# EasyEDA Pro project SlimeVR.eprj

# Schematic 板子原理图
Board Name: SlimeVR; Create Date: 2025-01-03; Page Name: 就这一页; Project Name: ReSlimeVR; Schematic Name: 板子原理图; Update Date: 2025-02-01; Company: 我们没有工作室(；´д｀)ゞ; Drawed: Abstract; Page Size: A4; Reviewed: Abstract; Version: V1.0
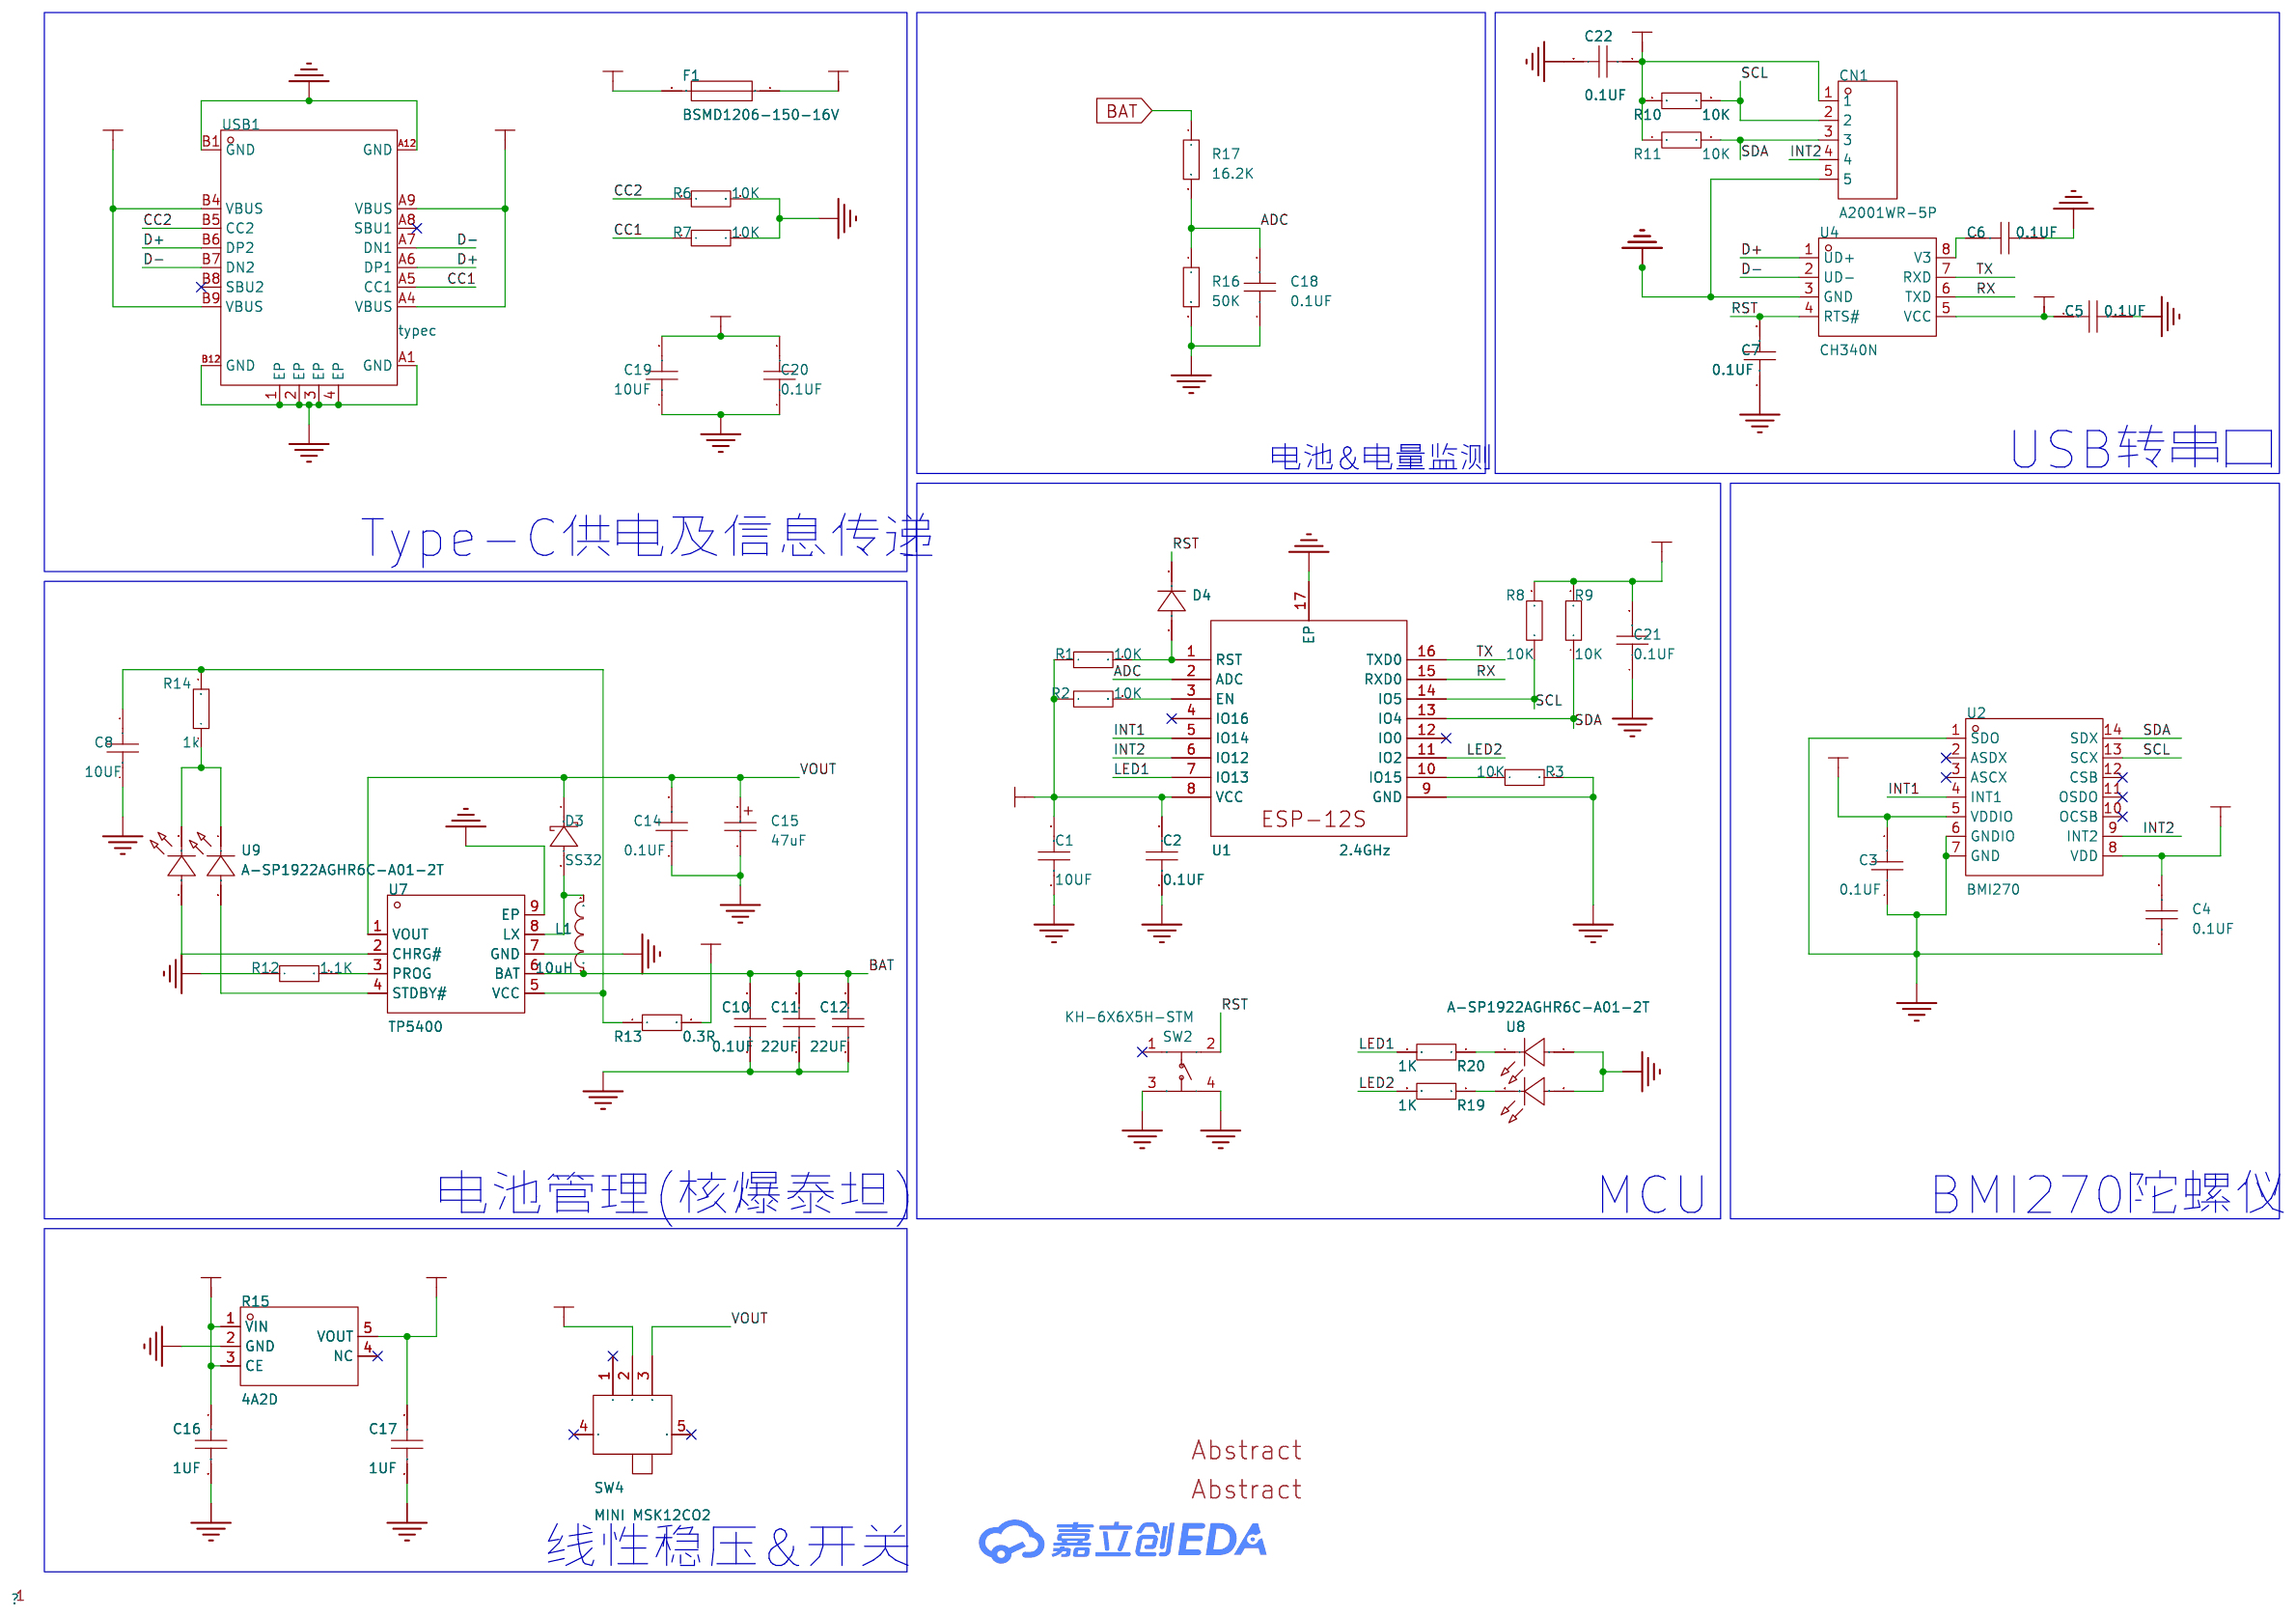
[diagram p0: schematic sheet]

## Parts
C1  10UF  [C0805]
C2  0.1UF  [C0805]
C3  0.1UF  [C0805]
C4  0.1UF  [C0805]
C5  0.1UF  [C0805]
C6  0.1UF  [C0805]
C7  0.1UF  [C0805]
C8  10UF  [C0805]
C10  0.1UF  [C0805]
C11  22UF  [C0805]
C12  22UF  [C0805]
C14  0.1UF  [C0805]
C15  47uF  [CASE-A_3216]
C16  1UF  [C0805]
C17  1UF  [C0805]
C18  0.1UF  [C0805]
C19  10UF  [C0805]
C20  0.1UF  [C0805]
C21  0.1UF  [C0805]
C22  0.1UF  [C0805]
CN1  A2001WR-5P  [CONN-TH_A2001WR-5P]
D3  SS32  [SMAF_L4.3-W2.5-LS5.0-RD]
D4  -  [SMA_1N4007]
F1  BSMD1206-150-16V  [F1206]
L1  10uH  [L0805]
R1  10K  [R0805]
R2  10K  [R0805]
R3  10K  [R0805]
R6  10K  [R0805]
R7  10K  [R0805]
R8  10K  [R0805]
R9  10K  [R0805]
R10  10K  [R0805]
R11  10K  [R0805]
R12  1.1K  [R0805]
R13  0.3R  [R0805]
R14  1k  [R0805]
R15  4A2D  [SOT-23-5_L3.0-W1.7-P0.95-LS2.8-BL]
R16  50K  [R0805]
R17  16.2K  [R0805]
R19  1K  [R0805]
R20  1K  [R0805]
SW2  KH-6X6X5H-STM  [SW-SMD_4P-L6.0-W6.0-P4.50-LS9.0-2]
SW4  MINI MSK12CO2  [SW-SMD_MSK12CO2]
U1  2.4GHz  [WIRELM-SMD_ESP-12S]
U2  BMI270  [LGA-14_L3.0-W2.5-P0.50-BR]
U4  CH340N  [SOP-8_L4.9-W3.9-P1.27-LS6.0-BL]
U7  TP5400  [ESOP-8_L4.9-W3.9-P1.27-LS6.0-BL-EP]
U8  A-SP1922AGHR6C-A01-2T  [LED-SMD_4P-L1.6-W1.5-BL-1]
U9  A-SP1922AGHR6C-A01-2T  [LED-SMD_4P-L1.6-W1.5-BL-1]
USB1  typec  [USB-C-SMD_KH-TYPE-C-16P]

## Library data of the parts
C1-C8 C10-C12 C14 C16-C22 = CAP_0805: Supplier Footprint: 0805
C15 = TAJA476K006RNJ: LCSC Part Name: 47uF ±10% 6.3V; Supplier Part: C7190; Manufacturer: Kyocera AVX; Supplier Footprint: CASE-A-3216; JLCPCB Part Class: 扩展库; Datasheet: https://atta.szlcsc.com/upload/public/pdf/source/20160107/1457707750344.pdf; Supplier: LCSC; Tolerance: ±10%; Rated Voltage: 6.3V; Equivalent Series Resistance(ESR): 1.6Ω@100kHz; Operating Temperature: -55℃~+125℃
CN1 = A2001WR-5P: LCSC Part Name: 系列:PH 间距:2mm 1x5P; Supplier Part: C225210; Manufacturer: CJT(长江连接器); Supplier Footprint: 弯插,P=2mm; JLCPCB Part Class: 扩展库; Datasheet: https://atta.szlcsc.com/upload/public/pdf/source/20180913/C273054_6FC7409D4269AF7235E8BCB17617615A.pdf; Supplier: LCSC; Pins Structure: 1x5P; Pitch: 2mm; Mounting Style: 弯插; Reference Series: PH; Number of Pins: 5P; Number of Rows: 1; Number of PINs Per Row: 5; Contact Material: 黄铜
D3 = SS32: LCSC Part Name: 电压:20V 电流:3A; Supplier Part: C727059; Manufacturer: TWGMC(台湾迪嘉); Supplier Footprint: SMA(DO-214AC); JLCPCB Part Class: 扩展库; Datasheet: https://atta.szlcsc.com/upload/public/pdf/source/20200828/C727059_6599B6CAC5F3238B9C33E46794659DBE.pdf; Supplier: LCSC; Diode Configuration: 独立式; Forward Voltage (Vf@If): 550mV@3A; Reverse Voltage (Vr): 20V; Rectified Current: 3A; Reverse Leakage Current (Ir): 500uA
D4 = D_1N4007: Supplier Footprint: SMA
F1 = BSMD1206-150-16V: LCSC Part Name: 16V 1.5A 1206自恢复; Supplier Part: C883133; Manufacturer: BHFUSE(佰宏); Supplier Footprint: 1206; JLCPCB Part Class: 扩展库; Datasheet: https://atta.szlcsc.com/upload/public/pdf/source/20230512/E419278EC8529AAF514173EF221BCF4B.pdf; Supplier: LCSC; Operating Voltage (Max): 16V; Current Rating (Max): 40A; Hold Current: 1.5A; Trip Current: 3A; Power Dissipation: 1W; Resistance - Initial (Ri) (Min): 25mΩ; Resistance - Post Trip (R1) (Max): 130mΩ; Maximum Time to Trip: 300ms; Operating Temperature: -40℃~+85℃
L1 = L_0805
R1-R3 R6-R14 R16 R17 R19 R20 = Res_0805: Supplier Footprint: 0805
R15 = 4A2D: Supplier Part: C2832127; Manufacturer: FM(富满); Supplier Footprint: SOT-23-5; JLCPCB Part Class: 扩展库; Datasheet: https://atta.szlcsc.com/upload/public/pdf/source/20211108/383E30205ACCFA4DE55639D1C9215A3C.pdf; Supplier: LCSC
SW2 = KH-6X6X5H-STM: LCSC Part Name: 6*6*5mm 立贴 轻触开关; Supplier Part: C2837531; Manufacturer: kinghelm(金航标); Supplier Footprint: SMD; JLCPCB Part Class: 扩展库; Datasheet: https://atta.szlcsc.com/upload/public/pdf/source/20210608/C2837531_45E87AB996CE723B09405FF2EA209C4C.pdf; Supplier: LCSC; Circuit: 单刀单掷; Actuator Style: 圆形按钮; Mounting Style: 立贴; Switch Length: 6mm; Switch Width: 6mm; Switch Height: 5mm; Strike Gundam: 不带; Contact Current: 50mA; Voltage Rating (DC): 12V; Actuator/Cap Color: 黑色; Pin Style: 鸥翼型; Mechanical Life: 8万次
SW4 = MINI MSK12CO2: LCSC Part Name: 迷你七脚两档侧拨拨动 mini七7脚 微型拨动; Supplier Part: C2681570; Manufacturer: SHOU HAN(首韩); Supplier Footprint: SMD; JLCPCB Part Class: 扩展库; Datasheet: https://atta.szlcsc.com/upload/public/pdf/source/20210224/C2681570_D263F9C605E4588A4AE6114B72AE4C72.pdf; Supplier: LCSC; Circuit: 单刀双掷; Pin Style: SMD接片; Switch Length: 5mm; Switch Width: 2.75mm; Switch Height: 1.4mm; Mounting Style: 卧贴; Current Rating (DC): 50mA; Voltage Rating (DC): 12V; Mechanical Life: 1万次; Operating Temperature: -16℃~+60℃
U1 = ESP-12S: Supplier Part: C82898; Manufacturer: Ai-Thinker(安信可); Supplier Footprint: SMD,16x24mm; JLCPCB Part Class: 扩展库; Datasheet: https://atta.szlcsc.com/upload/public/pdf/source/20180726/C82898_9FA1708C134FC93491C81360A8B073B0.pdf; Supplier: LCSC; Core Processor: ESP8266芯片; Wireless Standard: 802.11b/g/n；IP；TCP; Support Interface: GPIO；UART；PWM；ADC; Antenna Type: 板载PCB天线; Output Power: 16dBm; Operating Voltage: 3.3V; Receive  Current: 56mA; Send  Current: 170mA; Sensitivity: -90dBm; Operating Temperature: -20℃~+85℃
U2 = BMI270: Supplier Part: C2836813; Manufacturer: Bosch(博世); Supplier Footprint: LGA-14(2.5x3); JLCPCB Part Class: 扩展库; Datasheet: https://atta.szlcsc.com/upload/public/pdf/source/20210625/C2836813_35E1F3F92097F45A3828DF13DDBA01A5.pdf; Supplier: LCSC; Sensor Type: 加速度计陀螺仪; Operating Temperature: -40℃~+85℃
U4 = CH340N: LCSC Part Name: USB转串口芯片CH340; Supplier Part: C2977777; Manufacturer: WCH(南京沁恒); Supplier Footprint: SOP-8; JLCPCB Part Class: 扩展库; Datasheet: https://atta.szlcsc.com/upload/public/pdf/source/20240313/115CDE92081B1D6CB446704AD5D0F5F2.pdf; Supplier: LCSC; Applications Function: USB转串口; Protocol: USB 2.0; Number of Channels: 1; Supply Voltage: 3.3V；5V; Data Rate: 2Mbps; Operating Temperature: -20℃~+70℃
U7 = TP5400: Supplier Part: C2891434; Manufacturer: TOPPOWER(南京拓微); Supplier Footprint: ESOP-8; JLCPCB Part Class: 扩展库; Datasheet: https://atta.szlcsc.com/upload/public/pdf/source/20210909/352D9D40D77A1DD73F7904E364EF004B.pdf; Supplier: LCSC
U8 U9 = A-SP1922AGHR6C-A01-2T: LCSC Part Name: 1615绿红双色正贴; Supplier Part: C19171268; Manufacturer: Amicc(欧密格光电); Supplier Footprint: SMD-4P,1.6x1.5mm; Datasheet: https://atta.szlcsc.com/upload/public/pdf/source/20231108/782416AD03B76E14CF2487C8CE3D30D8.pdf; Supplier: LCSC; Emitted Color: 红色,绿色; Power Dissipation: 95mW；60mW; Dominant Wavelength: 515nm~530nm；622nm; Lens Color: 无色透明透镜; Luminous Intensity: 180mcd~285mcd；360mcd~900mcd; Viewing Angle: 130°; Mounting Sytle: 正贴; Operating Temperature: -40℃~+85℃
USB1 = typec: Supplier Part: C9900016956; Supplier Footprint: typec 12p; JLCPCB Part Class: 扩展库; Supplier: LCSC

## Nets
3.3V: C1.2 C2.2 C3.2 C4.2 C17.1 C21.2 C22.1 CN1.1 R1.1 R2.1 R8.2 R9.2 R10.1 R11.1 R15.5(VOUT) U1.8(VCC) U2.5(VDDIO) U2.8(VDD)
5V: C16.1 R15.1(VIN) R15.3(CE) SW4.2
GND: C1.1 C2.1 C3.1 C4.1 C5.2 C6.2 C7.1 C8.1 C10.1 C11.1 C12.1 C14.1 C15.2 C16.2 C17.2 C18.1 C19.1 C20.1 C21.1 C22.2 CN1.5 R3.2 R6.2 R7.2 R12.1 R15.2(GND) R16.2 SW2.3 SW2.4 U1.9(GND) U1.17(EP) U2.1(SDO) U2.6(GNDIO) U2.7(GND) U4.3(GND) U7.7(GND) U7.9(EP) U8.1 U8.2 USB1.1(EP) USB1.2(EP) USB1.3(EP) USB1.4(EP) USB1.A1(GND) USB1.A12(GND) USB1.B1(GND) USB1.B12(GND)
VBUS: C19.2 C20.2 F1.1 USB1.A4(VBUS) USB1.A9(VBUS) USB1.B4(VBUS) USB1.B9(VBUS)
ADC: C18.2 R16.1 R17.2 U1.2(ADC)
BAT: C10.2 C11.2 C12.2 L1.1 R17.1 U7.6(BAT)
CC1: R7.1 USB1.A5(CC1)
CC2: R6.1 USB1.B5(CC2)
D+: U4.1(UD+) USB1.A6(DP1) USB1.B6(DP2)
D-: U4.2(UD-) USB1.A7(DN1) USB1.B7(DN2)
INT1: U1.5(IO14) U2.4(INT1)
INT2: CN1.4 U1.6(IO12) U2.9(INT2)
LED1: R20.2 U1.7(IO13)
LED2: R19.2 U1.11(IO2)
RST: C7.2 D4.1(K) SW2.2 U4.4(RTS#)
RX: U1.15(RXD0) U4.6(TXD)
SCL: CN1.2 R8.1 R10.2 U1.14(IO5) U2.13(SCX)
SDA: CN1.3 R9.1 R11.2 U1.13(IO4) U2.14(SDX)
TX: U1.16(TXD0) U4.7(RXD)
USB_5V: C5.1 F1.2 R13.2 U4.5(VCC)
VOUT: C14.2 C15.1 D3.1(C) SW4.3 U7.1(VOUT)
$1N3843: R2.2 U1.3(EN)
$1N4055: R3.1 U1.10(IO15)
$1N5434: C6.1 U4.8(V3)
$1N6595: R12.2 U7.3(PROG)
$1N6687: U7.2(CHRG#) U9.2
$1N6762: R14.1 U9.3 U9.4
$1N6910: C8.2 R13.1 R14.2 U7.5(VCC)
$1N6997: D3.2(A) L1.2 U7.8(LX)
$1N12086: R20.1 U8.4
$1N12120: R19.1 U8.3
$1N16261: D4.2(A) R1.2 U1.1(RST)
$1N16506: U7.4(STDBY#) U9.1

Not connected (* = marked no-connect by the designer): R15 4(NC)*; SW2 1*; SW4 1* 4* 5*; U1 4(IO16)* 12(IO0)*; U2 2(ASDX)* 3(ASCX)* 10(OCSB)* 11(OSDO)* 12(CSB)*; USB1 A8(SBU1)* B8(SBU2)*

## Notes on the sheet
- 电池&电量监测
- USB转串口
- Type-C供电及信息传递
- 电池管理(核爆泰坦)
- MCU
- BMI270陀螺仪
- 线性稳压&开关

# Board 抽象设计
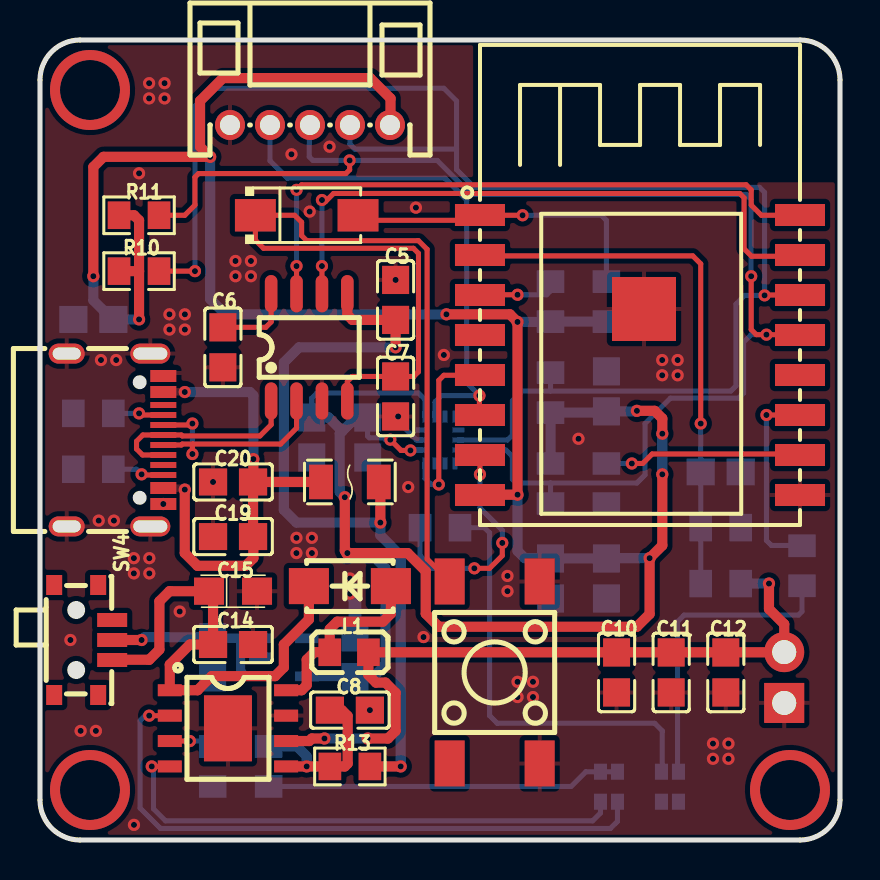
[diagram p1: board, top side]
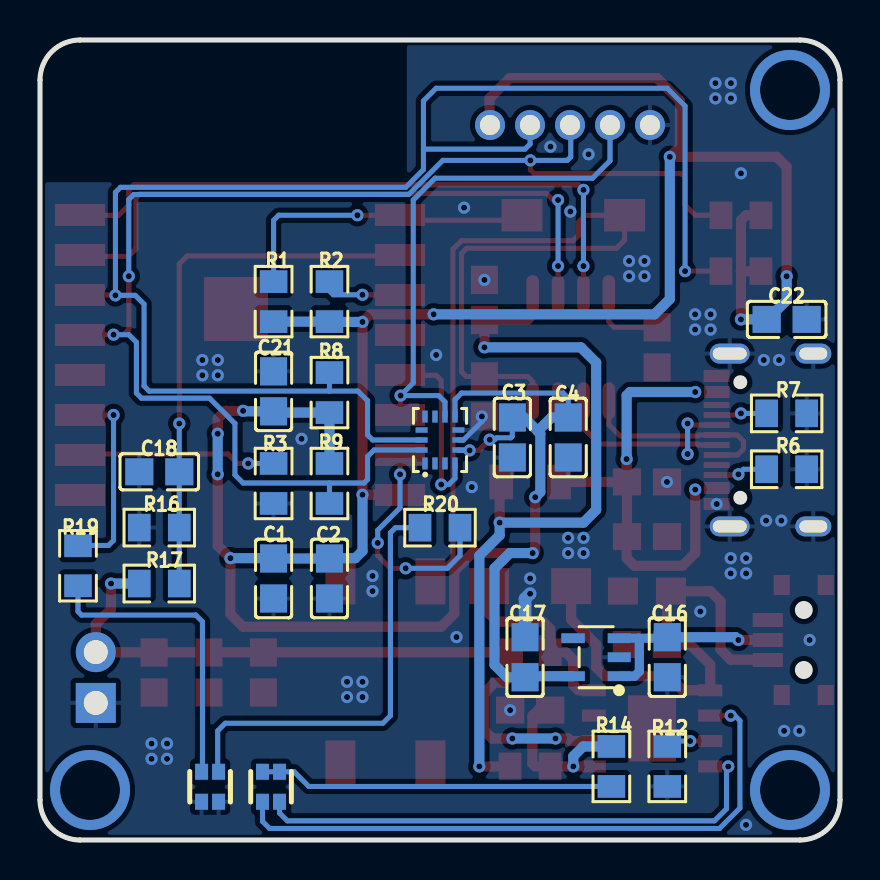
[diagram p2: board, bottom side, seen from below]

Outline 40 x 40 mm; copper layers: Top Layer, Bottom Layer. Coordinates in mm from the lower left corner of the outline.
Outline path: 0,38 0,2 arc(0.59,0.59) 2,0 38,0 arc(39.41,0.59) 40,2 40,38 arc(39.41,39.41) 38,40 2,40 arc(0.59,39.41) 0,38
Stack: Top Layer 0.035mm / Dielectric1 1.51mm FR4 er 4.5 / Bottom Layer 0.035mm

## Design rules (mm)
net D-: DP1
template: JLCPCB Capability(Two Layers Board)
spacing copperThickness1oz (default): track to track 0.102, other pairs 0.152 to 0.3
spacing copperThickness2oz: track to track 0.203, other pairs 0.152 to 0.3
track width copperThickness1oz (default): min 0.127, default 0.254, max 2.54
track width copperThickness2oz: min 0.203, default 0.254, max 2.54
differential pair differentialPair (default): width min 0.127, default 0.254, max 2.54; gap min 0.152, default 0.152
via viaSize (default): diameter min 0.5, default 0.61, max 10; hole min 0.3, default 0.305, max 6.3

## Placement (name value [footprint] x y rotation side)
C1  10UF  [C0805]  28.32 13.08 90 bottom
C2  0.1UF  [C0805]  25.53 13.08 90 bottom
C3  0.1UF  [C0805]  16.38 20.13 90 bottom
C4  0.1UF  [C0805]  13.59 20.13 90 bottom
C5  0.1UF  [C0805]  17.78 27 90 top
C6  0.1UF  [C0805]  9.14 24.63 270 top
C7  0.1UF  [C0805]  17.78 22.18 90 top
C8  10UF  [C0805]  15.49 6.49 180 top
C10  0.1UF  [C0805]  28.83 8.38 90 top
C11  22UF  [C0805]  31.56 8.38 90 top
C12  22UF  [C0805]  34.29 8.38 90 top
C14  0.1UF  [C0805]  9.65 9.77 180 top
C15  47uF  [CASE-A_3216]  9.65 12.44 0 top
C16  1UF  [C0805]  8.64 9.14 270 bottom
C17  1UF  [C0805]  15.75 9.14 90 bottom
C18  0.1UF  [C0805]  34.04 18.41 180 bottom
C19  10UF  [C0805]  9.65 15.17 0 top
C20  0.1UF  [C0805]  9.65 17.9 0 top
C21  0.1UF  [C0805]  28.32 22.43 270 bottom
C22  0.1UF  [C0805]  2.67 26.03 180 bottom
CN1  A2001WR-5P  [CONN-TH_A2001WR-5P]  13.5 35.75 0 top
D3  SS32  [SMAF_L4.3-W2.5-LS5.0-RD]  15.49 12.69 0 top
D4  -  [SMA_1N4007]  13.34 31.24 0 top
F1  BSMD1206-150-16V  [F1206]  15.49 17.9 0 top
L1  10uH  [L0805]  15.45 9.39 180 top
NOREF  -  [Pad_e1921]  37.21 6.85 90 top
NOREF#2  -  [Pad_e1918]  37.21 9.39 90 top
R1  10K  [R0805]  28.32 26.92 90 bottom
R2  10K  [R0805]  25.53 26.92 90 bottom
R3  10K  [R0805]  28.32 17.83 270 bottom
R6  10K  [R0805]  2.67 18.54 180 bottom
R7  10K  [R0805]  2.67 21.33 180 bottom
R8  10K  [R0805]  25.53 22.37 270 bottom
R9  10K  [R0805]  25.53 17.83 90 bottom
R10  10K  [R0805]  4.95 28.44 0 top
R11  10K  [R0805]  4.95 31.24 0 top
R12  1.1K  [R0805]  8.64 3.68 90 bottom
R13  0.3R  [R0805]  15.49 3.68 0 top
R14  1k  [R0805]  11.43 3.68 90 bottom
R15  4A2D  [SOT-23-5_L3.0-W1.7-P0.95-LS2.8-BL]  12.19 9.14 90 bottom
R16  50K  [R0805]  34.04 15.62 0 bottom
R17  16.2K  [R0805]  34.04 12.82 180 bottom
R19  1K  [R0805]  38.1 13.71 90 bottom
R20  1K  [R0805]  20 15.62 180 bottom
SW2  KH-6X6X5H-STM  [SW-SMD_4P-L6.0-W6.0-P4.50-LS9.0-2]  22.73 8.38 90 top
SW4  MINI MSK12CO2  [SW-SMD_MSK12CO2]  2.16 10 270 top
U1  2.4GHz  [WIRELM-SMD_ESP-12S]  30 24.25 0 top
U2  BMI270  [LGA-14_L3.0-W2.5-P0.50-BR]  20 20 270 bottom
U4  CH340N  [SOP-8_L4.9-W3.9-P1.27-LS6.0-BL]  13.46 24.63 0 top
U7  TP5400  [ESOP-8_L4.9-W3.9-P1.27-LS6.0-BL-EP]  9.4 5.58 270 top
U8  A-SP1922AGHR6C-A01-2T  [LED-SMD_4P-L1.6-W1.5-BL-1]  31.5 2.66 90 bottom
U9  A-SP1922AGHR6C-A01-2T  [LED-SMD_4P-L1.6-W1.5-BL-1]  28.45 2.66 90 bottom
USB1  typec  [USB-C-SMD_KH-TYPE-C-16P]  3.75 20 270 top

## Footprints (pads in the part's own frame, mm; a bottom-side part is the same pattern mirrored in y, then rotated)
C0805
  rect 1.41x1.35 smd: 1(-1,0) 2(1,0)
CASE-A_3216
  rect 1.5x1.359 smd: 1(-1.2,0) 2(1.2,0)
CONN-TH_A2001WR-5P
  round 1.5 hole 1: 1(4,0) 2(2,0) 3(0,0) 4(-2,0) 5(-4,0)
ESOP-8_L4.9-W3.9-P1.27-LS6.0-BL-EP
  rect 0.6x1.2 smd: 1(-1.905,-2.909) 2(-0.635,-2.909) 3(0.635,-2.909) 4(1.905,-2.909) 5(1.905,2.909) 6(0.635,2.909) 7(-0.635,2.909) 8(-1.905,2.909)
  rect 3.3x2.4 smd: 9(0,0)
F1206
  rect 1.19x1.728 smd: 1(-1.445,0) 2(1.445,0)
L0805
  rect 1.133x1.377 smd: 1(-0.966,0) 2(0.966,0)
LED-SMD_4P-L1.6-W1.5-BL-1
  rect 0.8x0.65 smd: 1(-0.75,-0.425) 2(-0.75,0.425) 3(0.75,0.425) 4(0.75,-0.425)
LGA-14_L3.0-W2.5-P0.50-BR
  rect 0.6x0.27 smd: 1(1.17,-0.75) 2(1.17,-0.25) 3(1.17,0.25) 4(1.17,0.75) 8(-1.17,0.75) 9(-1.17,0.25) 10(-1.17,-0.25) 11(-1.17,-0.75)
  rect 0.27x0.6 smd: 5(0.5,0.92) 6(0,0.92) 7(-0.5,0.92) 12(-0.5,-0.92) 13(0,-0.92) 14(0.5,-0.92)
Pad_e1918
  round 2 hole 1.2: 1(0,0)
Pad_e1921
  rect 2x2 hole 1.2: 1(0,0)
R0805
  rect 1.133x1.377 smd: 1(-1,0) 2(1,0)
SMA_1N4007
  rect 2.046x1.62 smd: 1(-2.566,0) 2(2.566,0)
SMAF_L4.3-W2.5-LS5.0-RD
  rect 2x1.8 smd: 1(-2.05,0) 2(2.05,0)
SOP-8_L4.9-W3.9-P1.27-LS6.0-BL
  oval 0.63x1.865 smd: 1(-1.905,-2.683) 2(-0.635,-2.683) 3(0.635,-2.683) 4(1.905,-2.683) 5(1.905,2.683) 6(0.635,2.683) 7(-0.635,2.683) 8(-1.905,2.683)
SOT-23-5_L3.0-W1.7-P0.95-LS2.8-BL
  rect 0.49x1.157 smd: 1(-0.95,-1.153) 2(0,-1.153) 3(0.95,-1.153)
  rect 0.49x1.175 smd: 4(0.95,1.153) 5(-0.95,1.153)
SW-SMD_4P-L6.0-W6.0-P4.50-LS9.0-2
  rect 2.3x1.5 smd: 1(-4.55,2.25) 2(4.55,2.25) 3(-4.55,-2.25) 4(4.55,-2.25)
SW-SMD_MSK12CO2
  rect 0.7x1.5 smd: 1(-1,1.45) 2(0,1.45) 3(1,1.45)
  rect 1x0.8 smd: 4(-2.75,0.75) 4(-2.75,-1.45) 5(2.75,0.75) 5(2.75,-1.45)
USB-C-SMD_KH-TYPE-C-16P
  oval 1x2 hole 0.6x1.7: 1(-4.32,1.765) 2(4.32,1.765)
  oval 1x1.8 hole 0.6x1.4: 3(-4.32,-2.415) 4(4.32,-2.415)
  rect 0.3x1.3 smd: A1(-3.35,2.415) A4(-2.55,2.415) A5(-1.25,2.415) A6(-0.25,2.415) A7(0.25,2.415) A8(1.25,2.415) A9(2.55,2.415) A12(3.35,2.415) B1(3.05,2.415) B4(2.25,2.415) B5(1.75,2.415) B6(0.75,2.415) B7(-0.75,2.415) B8(-1.75,2.415) B9(-2.25,2.415) B12(-3.05,2.415)
WIRELM-SMD_ESP-12S
  rect 2.5x1.1 smd: 1(-8.002,7) 2(-8.002,5) 3(-8,3) 4(-8.002,1) 5(-8.002,-1) 6(-8.002,-3) 7(-8.002,-5) 8(-8.001,-7) 9(8.001,-7) 10(8,-5) 11(8.001,-3) 12(8,-1) 13(8.001,1) 14(8.002,3) 15(8.001,5) 16(8,7)
  rect 3.2x3.2 smd: 17(0.2,2.3)

## Nets
As in the schematic, except:
GND: C1.1 C2.1 C3.1 C4.1 C5.2 C6.2 C7.1 C8.1 C10.1 C11.1 C12.1 C14.1 C15.2 C16.2 C17.2 C18.1 C19.1 C20.1 C21.1 C22.2 CN1.5 NOREF.1 R3.2 R6.2 R7.2 R12.1 R15.2 R16.2 SW2.3 SW2.4 U1.9 U1.17 U2.1 U2.6 U2.7 U4.3 U7.7 U7.9 U8.1 U8.2 USB1.1 USB1.2 USB1.3 USB1.4 USB1.A1 USB1.A12 USB1.B1 USB1.B12
BAT: C10.2 C11.2 C12.2 L1.1 NOREF#2.1 R17.1 U7.6

Pads without a net: R15 4; SW2 1; SW4 1 4 5; U1 4 12; U2 2 3 10 11 12; USB1 A8 B8

## Via types
v1: diameter 4, hole 3, Top Layer to Bottom Layer, 3 vias
v2: diameter 0.61, hole 0.305, Top Layer to Bottom Layer, 110 vias

## Routing (per net, layer and track width the routed paths; a pad name or vN(x,y) marks a point on that pad's centre or on a via; arc(x,y) is an arc through that point)
3.3V: length 153.9
  Top Layer w0.254: v2(18.52,19.48) 18.05,19.48 v2(17.51,20.02)
  Top Layer w0.508: R11.1 4.7,31.24 4.95,30.98 4.95,28.44 ; CN1.1 17.53,35.78 17.53,37.08 16.51,38.09 9.14,38.09 8,36.95 8,34.67 v2(8.51,34.16) 3.18,34.16 2.67,33.65 v2(2.67,28.19) ; v2(4.95,26.03) 4.95,28.44 ; 4.95,28.44 R10.1 ; U1.8 22.01,17.27 v2(23.88,17.27) v2(23.88,25.9) 23.5,26.28 v2(20.32,26.28) ; v2(31.12,20.31) 31.12,21.08 30.73,21.46 v2(29.84,21.46) ; v2(31.12,18.28) 31.12,14.73 v2(30.48,14.09) 30.48,11.3 29.84,10.66 19.94,10.66 19.29,11.31 19.29,13.44 18.38,14.35 v2(15.37,14.35) 15.24,14.47 v2(15.24,17.14)
  Bottom Layer w0.254: v2(18.52,19.48) 19.06,19.48 U2.5 ; U2.8 19.25,22.02 18.92,22.35 13.84,22.35 13.59,22.09 C4.2 ; C3.2 16.38,20.19 16.46,20.11 17.17,20.11 17.27,20.02 v2(17.51,20.02)
  Bottom Layer w0.508: v2(31.12,18.28) v2(31.12,20.31) ; 15.11,20.44 15.8,21.13 C3.2 ; 15.11,20.44 14.99,20.31 14.99,17.39 v2(15.24,17.14) ; 15.11,20.44 14.43,21.13 C4.2 ; v2(30.48,14.09) 28.34,14.09 C1.2 C2.2 25.51,14.09 24.24,14.09 23.88,14.45 v2(23.88,17.27) ; v2(4.95,26.03) C22.1 3.62,26.03 2.67,26.98 v2(2.67,28.19) ; v2(29.84,21.46) 29.82,21.43 C21.2 28.32,21.37 R8.2 R9.2 ; R15.5 15.7,8.19 C17.1 16.65,8.14 17.27,8.76 17.27,13.58 16.51,14.35 v2(15.37,14.35) ; R1.1 R2.1 25.51,25.9 v2(23.88,25.9) ; v2(20.32,26.28) 9.27,26.28 8.51,27.05 v2(8.51,34.16)
5V: length 10.3
  Top Layer w0.508: SW4.2 v2(5.08,10)
  Bottom Layer w0.457: 10.08,10.09 10.03,10.04 10.03,8.42 10.27,8.19 R15.1 ; 10.08,10.09 8.69,10.09 C16.1 ; 10.08,10.09 R15.3
  Bottom Layer w0.508: C16.1 5.22,10.14 v2(5.08,10)
GND: length 4.1
  Bottom Layer w0.254: v2(17.91,21.18) 17.91,20.92 18.82,20 U2.6
  Bottom Layer w0.635: C17.2 15.75,12.06 v2(15.49,12.31)
  vias: v2(1.52,10) v2(2.03,5.46) v2(2.79,5.46) v2(2.93,15.97) v2(3.05,24) v2(3.7,15.97) v2(3.81,24) v2(4.69,14.09) v2(4.69,13.33) v2(4.7,0.76) v2(4.95,33.33) v2(5.46,37.84) v2(5.46,37.08) v2(5.47,14.09) v2(5.47,13.33) v2(6.23,37.84) v2(6.23,37.08) v2(6.16,16.8) v2(6.47,26.28) v2(6.47,25.52) v2(6.99,11.42) v2(7.24,26.28) v2(7.24,25.52) v2(8.65,17.9) v2(9.77,28.95) v2(9.77,28.19) v2(10.55,28.95) v2(10.55,28.19) v2(12.57,34.28) v2(12.82,15.11) v2(12.82,14.35) v2(13.48,31.42) v2(13.59,15.11) v2(13.59,14.35) v2(14.48,34.67) v2(15.49,13.08) v2(16.49,6.49) v2(17.78,28) v2(18.41,17.65) v2(18.8,31.62) v2(19.18,10.15) v2(20.19,24.25) v2(23.37,13.2) v2(23.37,12.44) v2(23.88,7.91) v2(23.88,7.15) v2(24.65,7.91) v2(24.65,7.15) v2(26.92,20.06) v2(31.11,24) v2(31.11,23.24) v2(31.88,24) v2(31.88,23.24) v2(33.65,4.82) v2(33.65,4.06) v2(34.42,4.82) v2(34.42,4.06)
VBUS: length 22.1
  Top Layer w0.508: v2(7.24,17.52) 7.24,14.35 7.87,13.71 10.29,13.71 10.67,14.09 10.67,15.16 C19.2 C20.2 ; C20.2 10.67,17.92 v2(10.67,19.05) ; C20.2 F1.1
  Bottom Layer w0.508: v2(10.67,19.05) 10.67,22.22 10.5,22.4 v2(7.24,22.4)
(no net):
  vias: v1(2.5,37.5) v1(2.5,2.5) v1(37.5,2.5)
ADC: length 27.2
  Top Layer w0.254: U1.2 22.04,29.2 32.64,29.2 33.04,28.81 v2(33.04,20.82)
  Bottom Layer w0.254: R17.2 R16.1 C18.2 v2(33.04,20.82)
BAT: length 36.4
  Top Layer w0.508: v2(16.38,5.08) 17.4,5.08 17.78,5.46 17.78,7.36 17.27,7.87 16.8,7.87 16.42,8.25 L1.1 37.2,9.39 NOREF#2.1 37.21,10.79 36.45,11.55 v2(36.45,12.82) ; v2(14.22,5.08) 13.59,5.08 13.46,4.95 U7.6
  Bottom Layer w0.508: v2(36.45,12.82) R17.1 ; v2(14.22,5.08) v2(16.38,5.08)
CC1: length 2.5
  Top Layer w0.254: v2(4.95,21.33) 5.03,21.25 USB1.A5
  Bottom Layer w0.254: R7.1 v2(4.95,21.33)
CC2: length 2.6
  Top Layer w0.254: v2(5.08,18.28) 5.11,18.25 USB1.B5
  Bottom Layer w0.254: R6.1 4.83,18.54 v2(5.08,18.28)
D+: length 10.1
  Top Layer w0.254: USB1.B6 5.13,19.25 4.83,19.55 4.83,19.93 5.14,20.25 USB1.A6 7.07,20.25 7.12,20.2 11,20.2 11.56,20.76 U4.1
D-: length 11.9
  Top Layer w0.254: USB1.A7 7.07,19.75 7.12,19.8 7.64,19.8 ; USB1.B7 7.55,20.75 v2(7.62,20.82) ; 7.64,19.8 7.62,19.78 v2(7.62,19.3) ; 7.64,19.8 12.03,19.8 12.83,20.6 U4.2
  Bottom Layer w0.254: v2(7.62,20.82) v2(7.62,19.3)
INT1: length 8.9
  Top Layer w0.254: v2(19.94,17.78) 19.94,22.98 20.19,23.24 21.98,23.24 U1.5
  Bottom Layer w0.254: U2.4 19.25,18.08 19.56,17.78 v2(19.94,17.78)
INT2: length 26.5
  Top Layer w0.254: v2(21.97,22.22) 21.97,21.28 U1.6
  Bottom Layer w0.254: U2.9 19.75,21.9 20.07,22.22 v2(21.97,22.22) 21.34,22.86 21.34,32 20.24,33.09 12.37,33.09 11.5,33.96 CN1.4
LED1: length 11.5
  Top Layer w0.254: v2(23.11,14.85) 23.11,14.22 22.48,13.58 v2(21.72,13.58) ; U1.7 v2(22,18.28)
  Bottom Layer w0.254: v2(23.11,14.85) 23.11,15.49 22,16.61 v2(22,18.28) ; R20.2 19,14.22 19.63,13.58 v2(21.72,13.58)
LED2: length 9.8
  Top Layer w0.254: U1.11 v2(36.32,21.25)
  Bottom Layer w0.254: v2(36.32,21.25) 36.32,14.98 36.58,14.73 38.08,14.73 R19.2
RST: length 47.1
  Top Layer w0.254: U4.4 15.37,22.92 15.62,23.18 C7.2 18.69,23.18 18.92,23.41 18.92,29.33 18.67,29.59 11.18,29.59 10.77,29.99 D4.1 12.73,31.24 13.08,30.89 13.08,30.22 13.34,29.97 18.92,29.97 19.35,29.53 19.35,14.06 20.48,12.93
RX: length 31.6
  Top Layer w0.254: U1.15 37.94,29.19 35.58,29.19 35.2,29.56 35.2,32.11 34.99,32.33 14.68,32.33 14.29,31.94 14.16,31.94 v2(14.1,32) ; v2(14.1,28.7) U4.6
  Bottom Layer w0.254: v2(14.1,32) v2(14.1,28.7)
SCL: length 79
  Top Layer w0.254: v2(36.23,27.23) 36.25,27.25 U1.14 ; R10.2 v2(7.75,28.44)
  Bottom Layer w0.254: CN1.2 15.49,35.74 15.49,34.8 15.75,34.55 20.83,34.55 ; 25.53,22.45 24.1,22.45 23.62,21.97 23.62,20.25 23.37,20 U2.13 ; 25.53,22.45 34.54,22.45 34.8,22.7 34.8,26.79 35.24,27.23 v2(36.23,27.23) 36.23,32.38 35.97,32.63 21.71,32.63 20.83,33.52 20.83,34.55 ; 25.53,22.45 R8.1 ; 20.83,34.55 20.83,36.95 20.19,37.59 8.64,37.59 7.75,36.7 v2(7.75,28.44)
SDA: length 69.2
  Top Layer w0.254: v2(15.48,33.98) 15.48,33.51 15.29,33.32 7.93,33.32 7.75,33.14 7.75,31.75 7.24,31.24 R11.2 ; U1.13 37.98,25.27 v2(36.32,25.27) 35.81,25.27 35.56,25.52 v2(35.56,28.19)
  Bottom Layer w0.254: 25.53,17.85 29.84,17.85 30.25,18.26 30.25,20.82 31.52,22.09 34.93,22.09 35.18,22.35 35.18,24.89 35.56,25.27 v2(36.32,25.27) ; 25.53,17.85 23.8,17.85 23.62,18.03 23.62,19.17 23.29,19.5 U2.14 ; 25.53,17.85 R9.1 ; v2(35.56,28.19) 35.56,32.02 35.31,32.28 21.56,32.28 19.86,33.98 v2(15.48,33.98) 13.64,33.98 13.46,34.16 13.46,35.71 CN1.3
TX: length 31.6
  Top Layer w0.254: v2(12.83,32.51) 13.08,32.76 35.31,32.76 35.56,32.51 35.56,31.75 36.07,31.24 37.99,31.24 U1.16 ; v2(12.83,28.7) U4.7
  Bottom Layer w0.254: v2(12.83,32.51) v2(12.83,28.7)
USB_5V: length 39.5
  Top Layer w0.508: v2(17.78,24.63) C5.1 15.62,26 15.37,26.26 U4.5 ; F1.2 17.02,17.82 v2(17.02,15.87) ; v2(18.03,3.68) R13.2
  Bottom Layer w0.508: v2(17.78,24.63) 12.95,24.63 12.19,23.87 12.19,16.5 12.83,15.87 v2(17.02,15.87) 17.02,15.23 18.03,14.22 v2(18.03,3.68)
VOUT: length 25.1
  Top Layer w0.508: SW4.3 3.62,9.01 5.46,9.01 5.97,9.52 5.97,11.93 6.48,12.44 C15.1 8.65,12.24 C14.2 7.49,9.77 6.49,8.77 U7.1 7.88,7.49 8.59,8.19 11.75,8.19 12.19,8.63 12.19,9.77 13.44,11.03 D3.1
$1N3843: length 4.1
  Top Layer w0.254: v2(23.88,27.26) 22.01,27.26 U1.3
  Bottom Layer w0.254: v2(23.88,27.26) 25.33,27.26 25.53,27.45 R2.2
$1N4055: length 9.9
  Top Layer w0.254: U1.10 37.95,19.3 30.61,19.3 30.13,18.83 v2(29.59,18.83)
  Bottom Layer w0.254: R3.1 v2(29.59,18.83)
$1N5434: length 3.9
  Top Layer w0.254: U4.8 11.56,25.9 11.29,25.63 C6.1
$1N6595: length 2.3
  Top Layer w0.254: U7.3 v2(7.49,4.95)
  Bottom Layer w0.254: v2(7.49,4.95) 8.37,4.95 R12.2
$1N6687: length 31.4
  Top Layer w0.254: v2(5.46,6.22) U7.2
  Bottom Layer w0.254: 28.87,1.91 28.87,0.93 28.52,0.58 6.02,0.58 5,1.59 5,5.96 5.26,6.22 v2(5.46,6.22)
$1N6762: length 17.7
  Bottom Layer w0.254: R14.1 26.56,2.68 27.29,3.41 U9.4 28.87,3.41
$1N6910: length 9.1
  Top Layer w0.508: U7.5 v2(13.34,3.68) R13.1 15.24,3.68 15.38,3.82 15.38,6.2 15.09,6.49 C8.2
  Bottom Layer w0.508: v2(13.34,3.68) 13.34,4.19 12.84,4.68 R14.2
$1N6997: length 9.6
  Top Layer w0.508: U7.8 13.08,7.49 13.34,7.74 13.34,9.01 13.72,9.39 14.48,9.39 L1.2 14.49,10.55 14.86,10.92 17.15,10.92 17.54,11.32 D3.2
$1N12086: length 21.7
  Bottom Layer w0.254: R20.1 22.22,15.62 22.48,15.36 22.48,6.22 22.86,5.84 30.73,5.84 31.12,5.46 31.12,3.46 U8.4
$1N12120: length 15.2
  Bottom Layer w0.254: R19.1 38.1,11.42 37.92,11.25 32.21,11.25 31.88,10.92 31.88,3.46 31.92,3.41
$1N16261: length 15.8
  Top Layer w0.254: v2(24.13,31.24) 22.01,31.24 U1.1 21.73,30.98 16.15,30.98 D4.2
  Bottom Layer w0.254: R1.2 28.32,30.98 28.07,31.24 v2(24.13,31.24)
$1N16506: length 26.4
  Top Layer w0.254: v2(5.59,3.68) U7.4
  Bottom Layer w0.254: v2(5.59,3.68) 5.67,3.59 5.67,1.56 6.28,0.96 27.63,0.96 28.02,1.35 U9.1

## Copper pours and planes (outline as drawn; the poured copper is in the pictures)
GND on Top Layer: -2.54,43.05 43.81,43.05 43.81,-2.54 -2.54,-2.54
GND on Bottom Layer: -2.79,42.29 41.78,42.29 41.78,-2.42 -2.79,-2.42

Small or netless copper shapes (teardrops, artwork), in the pictures only: 2 on Top Layer
